# EAGLE design people-counter-74xx (EAGLE 9.1.2)
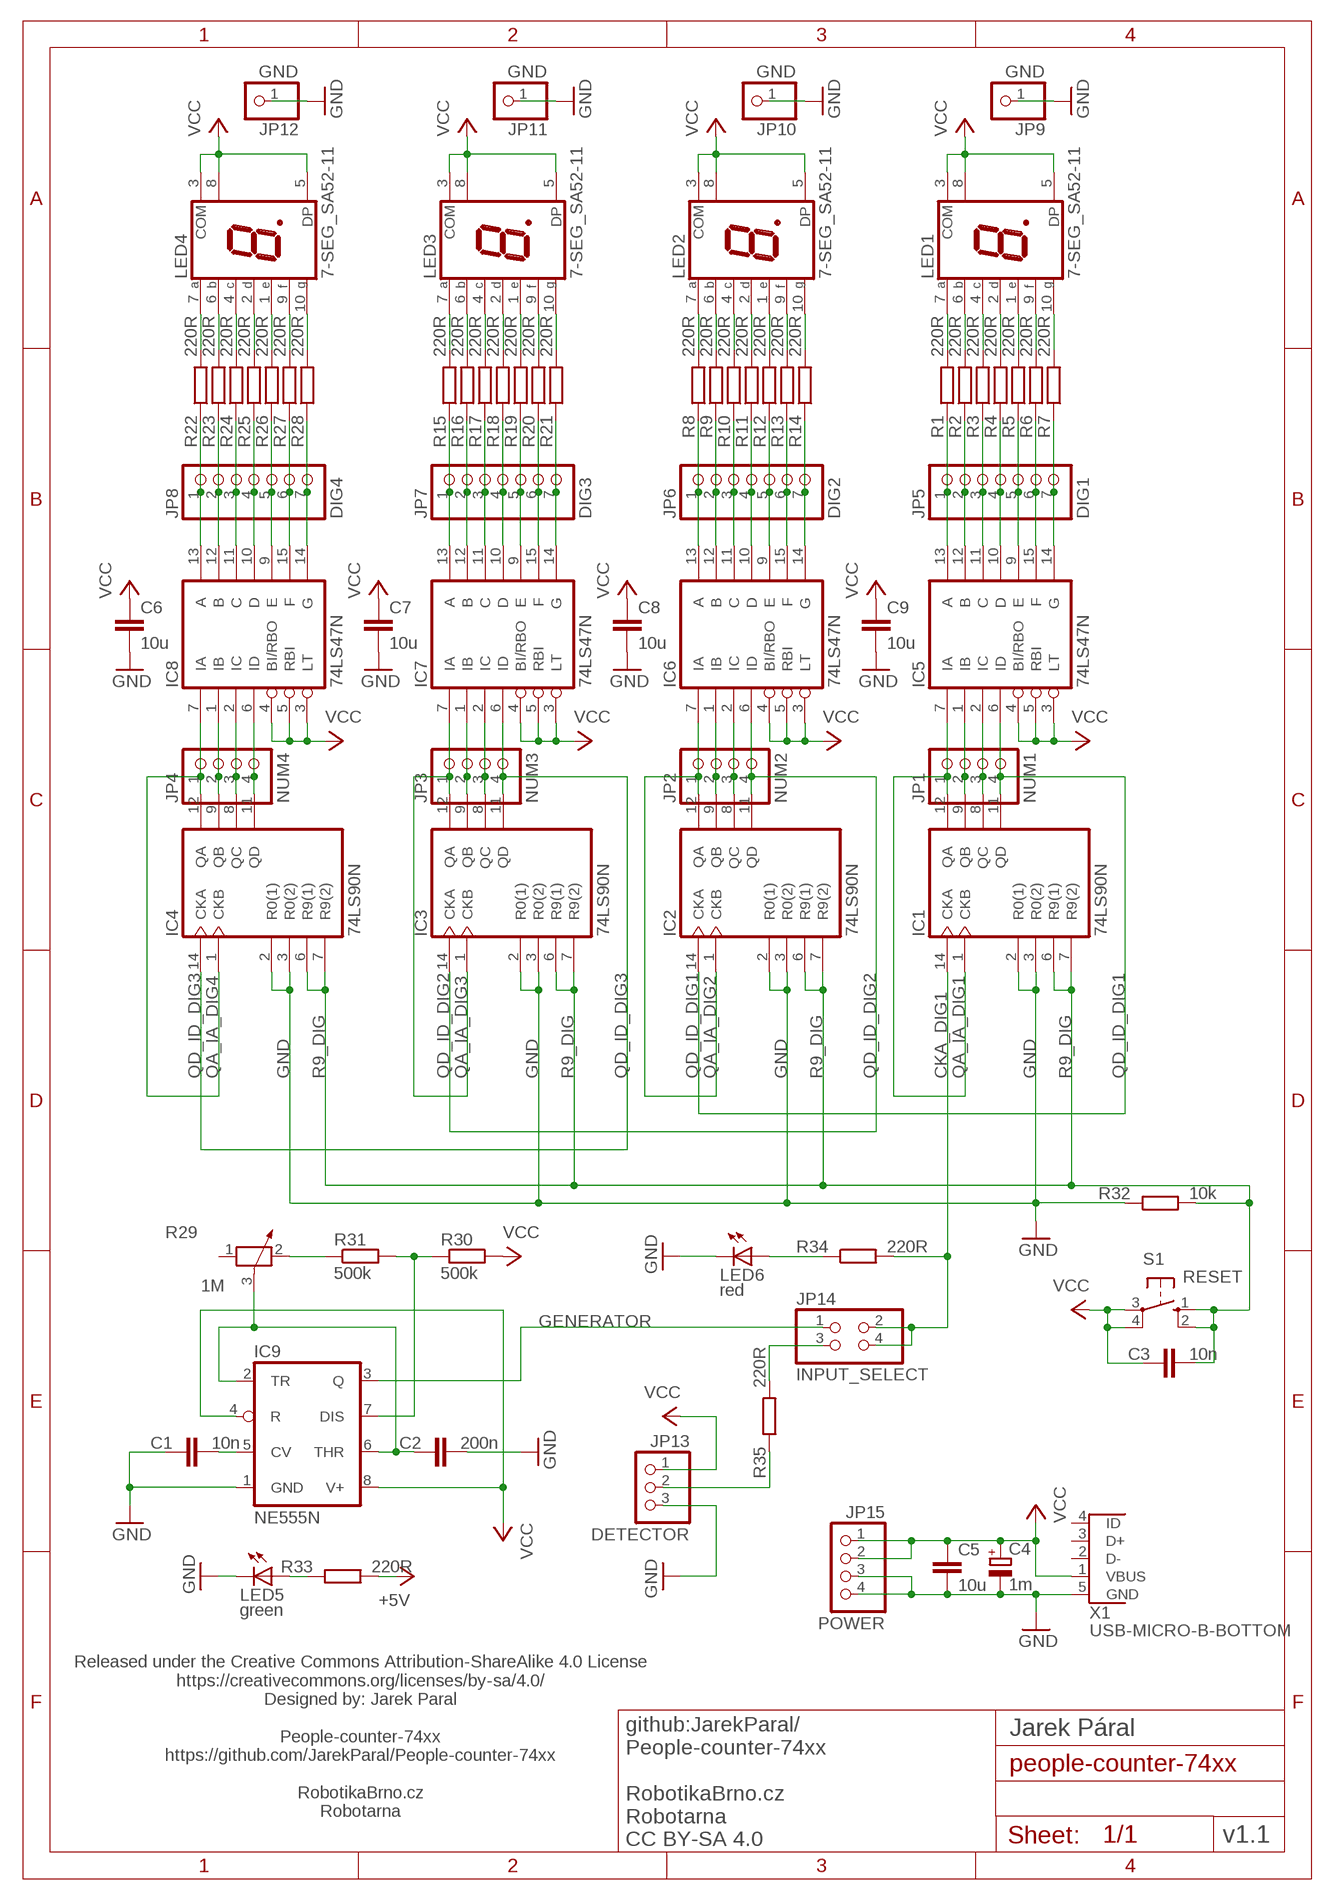
[diagram p0: schematic, sheet 1]

## Parts
C1  10n  C-EUC0603  [C0603]
C2  200n  C-EUC0805  [C0805]
C3  10n  C-EUC0603  [C0603]
C4  1m  CPOL-EUE5-10.5  [E5-10,5]
C5  10u  C-EUC0805  [C0805]
C6  10u  C-EUC0805  [C0805]
C7  10u  C-EUC0805  [C0805]
C8  10u  C-EUC0805  [C0805]
C9  10u  C-EUC0805  [C0805]
IC1  74LS90N  [DIL14]
IC2  74LS90N  [DIL14]
IC3  74LS90N  [DIL14]
IC4  74LS90N  [DIL14]
IC5  74LS47N  [DIL16]
IC6  74LS47N  [DIL16]
IC7  74LS47N  [DIL16]
IC8  74LS47N  [DIL16]
IC9  NE555N  [DIL08]
JP1  NUM1  PINHD-1X4  [1X04]
JP2  NUM2  PINHD-1X4  [1X04]
JP3  NUM3  PINHD-1X4  [1X04]
JP4  NUM4  PINHD-1X4  [1X04]
JP5  DIG1  PINHD-1X7  [1X07]
JP6  DIG2  PINHD-1X7  [1X07]
JP7  DIG3  PINHD-1X7  [1X07]
JP8  DIG4  PINHD-1X7  [1X07]
JP9  GND  PINHD-1X1  [1X01]
JP10  GND  PINHD-1X1  [1X01]
JP11  GND  PINHD-1X1  [1X01]
JP12  GND  PINHD-1X1  [1X01]
JP13  DETECTOR  PINHD-1X3/90  [1X03/90]
JP14  INPUT_SELECT  PINHD-2X2  [2X02]
JP15  POWER  PINHD-1X4/90  [1X04/90]
LED1  7-SEG_SA52-11  [SA52-11]
LED2  7-SEG_SA52-11  [SA52-11]
LED3  7-SEG_SA52-11  [SA52-11]
LED4  7-SEG_SA52-11  [SA52-11]
LED5  green  LEDCHIPLED_0603  [CHIPLED_0603]
LED6  red  LEDCHIPLED_0603  [CHIPLED_0603]
R1  220R  R-EU_R0603  [R0603]
R2  220R  R-EU_R0603  [R0603]
R3  220R  R-EU_R0603  [R0603]
R4  220R  R-EU_R0603  [R0603]
R5  220R  R-EU_R0603  [R0603]
R6  220R  R-EU_R0603  [R0603]
R7  220R  R-EU_R0603  [R0603]
R8  220R  R-EU_R0603  [R0603]
R9  220R  R-EU_R0603  [R0603]
R10  220R  R-EU_R0603  [R0603]
R11  220R  R-EU_R0603  [R0603]
R12  220R  R-EU_R0603  [R0603]
R13  220R  R-EU_R0603  [R0603]
R14  220R  R-EU_R0603  [R0603]
R15  220R  R-EU_R0603  [R0603]
R16  220R  R-EU_R0603  [R0603]
R17  220R  R-EU_R0603  [R0603]
R18  220R  R-EU_R0603  [R0603]
R19  220R  R-EU_R0603  [R0603]
R20  220R  R-EU_R0603  [R0603]
R21  220R  R-EU_R0603  [R0603]
R22  220R  R-EU_R0603  [R0603]
R23  220R  R-EU_R0603  [R0603]
R24  220R  R-EU_R0603  [R0603]
R25  220R  R-EU_R0603  [R0603]
R26  220R  R-EU_R0603  [R0603]
R27  220R  R-EU_R0603  [R0603]
R28  220R  R-EU_R0603  [R0603]
R29  1M  POTENTIOMETER_PT-10  [PT-10]
R30  500k  R-EU_R0603  [R0603]
R31  500k  R-EU_R0603  [R0603]
R32  10k  R-EU_R0603  [R0603]
R33  220R  R-EU_R0603  [R0603]
R34  220R  R-EU_R0603  [R0603]
R35  220R  R-EU_R0603  [R0603]
S1  RESET  10-XX  [B3F-10XX]
X1  USB-MICRO-B-BOTTOM  [USB-MICRO-B-BOTTOM-MOLEX]

## Nets
+5V: R33.2
A_DIG1: IC5.13(A) JP5.1 R1.1
A_DIG2: IC6.13(A) JP6.1 R8.1
A_DIG3: IC7.13(A) JP7.1 R15.1
A_DIG4: IC8.13(A) JP8.1 R22.1
A_DIG_1: LED1.7(A) R1.2
A_DIG_2: LED2.7(A) R8.2
A_DIG_3: LED3.7(A) R15.2
A_DIG_4: LED4.7(A) R22.2
B_DIG1: IC5.12(B) JP5.2 R2.1
B_DIG2: IC6.12(B) JP6.2 R9.1
B_DIG3: IC7.12(B) JP7.2 R16.1
B_DIG4: IC8.12(B) JP8.2 R23.1
B_DIG_1: LED1.6(B) R2.2
B_DIG_2: LED2.6(B) R9.2
B_DIG_3: LED3.6(B) R16.2
B_DIG_4: LED4.6(B) R23.2
C_DIG1: IC5.11(C) JP5.3 R3.1
C_DIG2: IC6.11(C) JP6.3 R10.1
C_DIG3: IC7.11(C) JP7.3 R17.1
C_DIG4: IC8.11(C) JP8.3 R24.1
C_DIG_1: LED1.4(C) R3.2
C_DIG_2: LED2.4(C) R10.2
C_DIG_3: LED3.4(C) R17.2
C_DIG_4: LED4.4(C) R24.2
CKA_DIG1: IC1.14(CKA) JP14.2 JP14.4 R34.2
D_DIG1: IC5.10(D) JP5.4 R4.1
D_DIG2: IC6.10(D) JP6.4 R11.1
D_DIG3: IC7.10(D) JP7.4 R18.1
D_DIG4: IC8.10(D) JP8.4 R25.1
D_DIG_1: LED1.2(D) R4.2
D_DIG_2: LED2.2(D) R11.2
D_DIG_3: LED3.2(D) R18.2
D_DIG_4: LED4.2(D) R25.2
E_DIG1: IC5.9(E) JP5.5 R5.1
E_DIG2: IC6.9(E) JP6.5 R12.1
E_DIG3: IC7.9(E) JP7.5 R19.1
E_DIG4: IC8.9(E) JP8.5 R26.1
E_DIG_1: LED1.1(E) R5.2
E_DIG_2: LED2.1(E) R12.2
E_DIG_3: LED3.1(E) R19.2
E_DIG_4: LED4.1(E) R26.2
F_DIG1: IC5.15(F) JP5.6 R6.1
F_DIG2: IC6.15(F) JP6.6 R13.1
F_DIG3: IC7.15(F) JP7.6 R20.1
F_DIG4: IC8.15(F) JP8.6 R27.1
F_DIG_1: LED1.9(F) R6.2
F_DIG_2: LED2.9(F) R13.2
F_DIG_3: LED3.9(F) R20.2
F_DIG_4: LED4.9(F) R27.2
G_DIG1: IC5.14(G) JP5.7 R7.1
G_DIG2: IC6.14(G) JP6.7 R14.1
G_DIG3: IC7.14(G) JP7.7 R21.1
G_DIG4: IC8.14(G) JP8.7 R28.1
G_DIG_1: LED1.10(G) R7.2
G_DIG_2: LED2.10(G) R14.2
G_DIG_3: LED3.10(G) R21.2
G_DIG_4: LED4.10(G) R28.2
GENERATOR: IC9.3(Q) JP14.1
GND: C1.1 C2.2 C4.- C5.2 C6.2 C7.2 C8.2 C9.2 IC1.2(R0(1)) IC1.3(R0(2)) IC2.2(R0(1)) IC2.3(R0(2)) IC3.2(R0(1)) IC3.3(R0(2)) IC4.2(R0(1)) IC4.3(R0(2)) IC9.1(GND) JP9.1 JP10.1 JP11.1 JP12.1 JP13.3 JP15.3 JP15.4 LED5.C LED6.C R32.1 X1.5(GND)
N$1: LED6.A R34.1
N$2: R29.2 R31.1
N$3: C2.1 IC9.2(TR) IC9.6(THR) R29.3
N$4: C1.2 IC9.5(CV)
N$6: IC9.7(DIS) R30.1 R31.2
N$11: LED5.A R33.1
QA_IA_DIG1: IC1.1(CKB) IC1.12(QA) IC5.7(IA) JP1.1
QA_IA_DIG2: IC2.1(CKB) IC2.12(QA) IC6.7(IA) JP2.1
QA_IA_DIG3: IC3.1(CKB) IC3.12(QA) IC7.7(IA) JP3.1
QA_IA_DIG4: IC4.1(CKB) IC4.12(QA) IC8.7(IA) JP4.1
QB_IB_DIG1: IC1.9(QB) IC5.1(IB) JP1.2
QB_IB_DIG2: IC2.9(QB) IC6.1(IB) JP2.2
QB_IB_DIG3: IC3.9(QB) IC7.1(IB) JP3.2
QB_IB_DIG4: IC4.9(QB) IC8.1(IB) JP4.2
QC_IC_DIG1: IC1.8(QC) IC5.2(IC) JP1.3
QC_IC_DIG2: IC2.8(QC) IC6.2(IC) JP2.3
QC_IC_DIG3: IC3.8(QC) IC7.2(IC) JP3.3
QC_IC_DIG4: IC4.8(QC) IC8.2(IC) JP4.3
QD_ID_DIG1: IC1.11(QD) IC2.14(CKA) IC5.6(ID) JP1.4
QD_ID_DIG2: IC2.11(QD) IC3.14(CKA) IC6.6(ID) JP2.4
QD_ID_DIG3: IC3.11(QD) IC4.14(CKA) IC7.6(ID) JP3.4
QD_ID_DIG4: IC4.11(QD) IC8.6(ID) JP4.4
R9_DIG: C3.2 IC1.6(R9(1)) IC1.7(R9(2)) IC2.6(R9(1)) IC2.7(R9(2)) IC3.6(R9(1)) IC3.7(R9(2)) IC4.6(R9(1)) IC4.7(R9(2)) R32.2 S1.1(S) S1.2(S1)
SIGNAL_INPUT: JP13.2 R35.1
SIGNAL_INPUT_: JP14.3 R35.2
VCC: C3.1 C4.+ C5.1 C6.1 C7.1 C8.1 C9.1 IC5.3(LT) IC5.4(BI/RBO) IC5.5(RBI) IC6.3(LT) IC6.4(BI/RBO) IC6.5(RBI) IC7.3(LT) IC7.4(BI/RBO) IC7.5(RBI) IC8.3(LT) IC8.4(BI/RBO) IC8.5(RBI) IC9.4(R) IC9.8(V+) JP13.1 JP15.1 JP15.2 LED1.3(COM) LED1.5(DP) LED1.8(COM) LED2.3(COM) LED2.5(DP) LED2.8(COM) LED3.3(COM) LED3.5(DP) LED3.8(COM) LED4.3(COM) LED4.5(DP) LED4.8(COM) R30.2 S1.3(P) S1.4(P1) X1.1(VBUS)
Unconnected: R29.1 X1.2(D-) X1.3(D+) X1.4(ID)

## Notes on the sheet
- Released under the Creative Commons Attribution-ShareAlike 4.0 License
  https://creativecommons.org/licenses/by-sa/4.0/
  Designed by: Jarek Paral
  
  People-counter-74xx
  https://github.com/JarekParal/People-counter-74xx
  
  RobotikaBrno.cz
  Robotarna
- Jarek Páral
- v1.1
- github:JarekParal/
  People-counter-74xx
  
  RobotikaBrno.cz
  Robotarna
  CC BY-SA 4.0

## Power pins joined to a net without a drawn wire
GND: IC1.10(GND) IC2.10(GND) IC3.10(GND) IC4.10(GND) IC5.8(GND) IC6.8(GND) IC7.8(GND) IC8.8(GND)
VCC: IC1.5(VCC) IC2.5(VCC) IC3.5(VCC) IC4.5(VCC) IC5.16(VCC) IC6.16(VCC) IC7.16(VCC) IC8.16(VCC)

## Library data of the parts
C1-C3 C5-C9 = rcl:C-EU: CAPACITOR, European symbol; SPICEPREFIX: C
C4 = rcl:CPOL-EU: POLARIZED CAPACITOR, European symbol; SPICEPREFIX: C
IC1-IC4 = 74xx-eu:74*90: Decade, divide by twelve and binary COUNTER
IC5-IC8 = 74xx-eu:74*47: BCD to seven segment DECODER/DRIVER Source: http://www.ee.washington.edu/stores/DataSheets/74ls/74ls47.pdf
IC9 = linear:*555: TIMER
JP1-JP4 JP15 = pinhead:PINHD-1X4: PIN HEADER
JP5-JP8 = pinhead:PINHD-1X7: PIN HEADER
JP9-JP12 = pinhead:PINHD-1X1: PIN HEADER
JP13 = pinhead:PINHD-1X3: PIN HEADER
JP14 = pinhead:PINHD-2X2: PIN HEADER
LED1-LED4 = display-kingbright:7-SEG_: Kingbright 14.2mm (0.56 INCH) SINGLE DIGIT NUMERIC DUISPLAY Source: SA56-11EWA(Ver1189471036.pdf; OC_FARNELL: unknown; OC_NEWARK: unknown
LED5 LED6 = led:LED: LED OSRAM: - CHIPLED LG R971, LG N971, LY N971, LG Q971, LY Q971, LO R971, LY R971 LH N974, LH R974 LS Q976, LO Q976, LY Q976 LO Q996 - Hyper CHIPLED LW Q18S LB Q993, LB Q99A, LB R99A - SideLED LS A670, LO A670, LY A670, LG A670, LP A670 LB A673, LV A673, LT A673, LW A673 LH A674 LY A675 LS A676, LA A676, LO A676, LY A676, LW A676 LS A679, LY A679, LG A679 - Hyper Micro SIDELED® LS Y876, LA Y876, LO Y876, LY Y876 LT Y87S - SmartLED LW L88C, LW L88S LB L89C, LB L89S, LG L890 LS L89K, LO L89K, LY L89K LS L896, LA L896, LO L896, LY L896 - TOPLED LS T670, LO T670, LY T670, LG T670, LP T670 LSG T670, LSP T670, LSY T670, LOP T670, LYG T670 LG T671, LOG T671, LSG T671 LB T673, LV T673, LT T673, LW T673 LH T674 LS T676, LA T676, LO T676, LY T676, LB T676, LH T676, LSB T676, LW T676 LB T67C, LV T67C, LT T67C, LS T67K, LO T67K, LY T67K, LW E67C LS E67B, LA E67B, LO E67B, LY E67B, LB E67C, LV E67C, LT E67C LW T67C LS T679, LY T679, LG T679 LS T770, LO T770, LY T770, LG T770, LP T770 LB T773, LV T773, LT T773, LW T773 LH T774 LS E675, LA E675, LY E675, LS T675 LS T776, LA T776, LO T776, LY T776, LB T776 LHGB T686 LT T68C, LB T68C - Hyper Mini TOPLED® LB M676 - Mini TOPLED Santana® LG M470 LS M47K, LO M47K, LY M47K Source: http://www.osram.convergy.de LUXEON: - LUMILED® LXK2-PW12-R00, LXK2-PW12-S00, LXK2-PW14-U00, LXK2-PW14-V00 LXK2-PM12-R00, LXK2-PM12-S00, LXK2-PM14-U00 LXK2-PE12-Q00, LXK2-PE12-R00, LXK2-PE12-S00, LXK2-PE14-T00, LXK2-PE14-U00 LXK2-PB12-K00, LXK2-PB12-L00, LXK2-PB12-M00, LXK2-PB14-N00, LXK2-PB14-P00, LXK2-PB14-Q00 LXK2-PR12-L00, LXK2-PR12-M00, LXK2-PR14-Q00, LXK2-PR14-R00 LXK2-PD12-Q00, LXK2-PD12-R00, LXK2-PD12-S00 LXK2-PH12-R00, LXK2-PH12-S00 LXK2-PL12-P00, LXK2-PL12-Q00, LXK2-PL12-R00 Source: www.luxeon.com KINGBRIGHT: KA-3528ASYC Source: www.kingbright.com
R1-R28 R30-R35 = rcl:R-EU_: RESISTOR, European symbol; SPICEPREFIX: R
R29 = rcl:POTENTIOMETER_: Potentiometer; OC_GME: 112-058; SPICEMODEL: POT; SPICEPREFIX: X
S1 = switch-omron:10-XX: OMRON SWITCH; MPN: B3F-1000; OC_FARNELL: 176432; OC_NEWARK: 36M3542
X1 = usb:USB

## Board
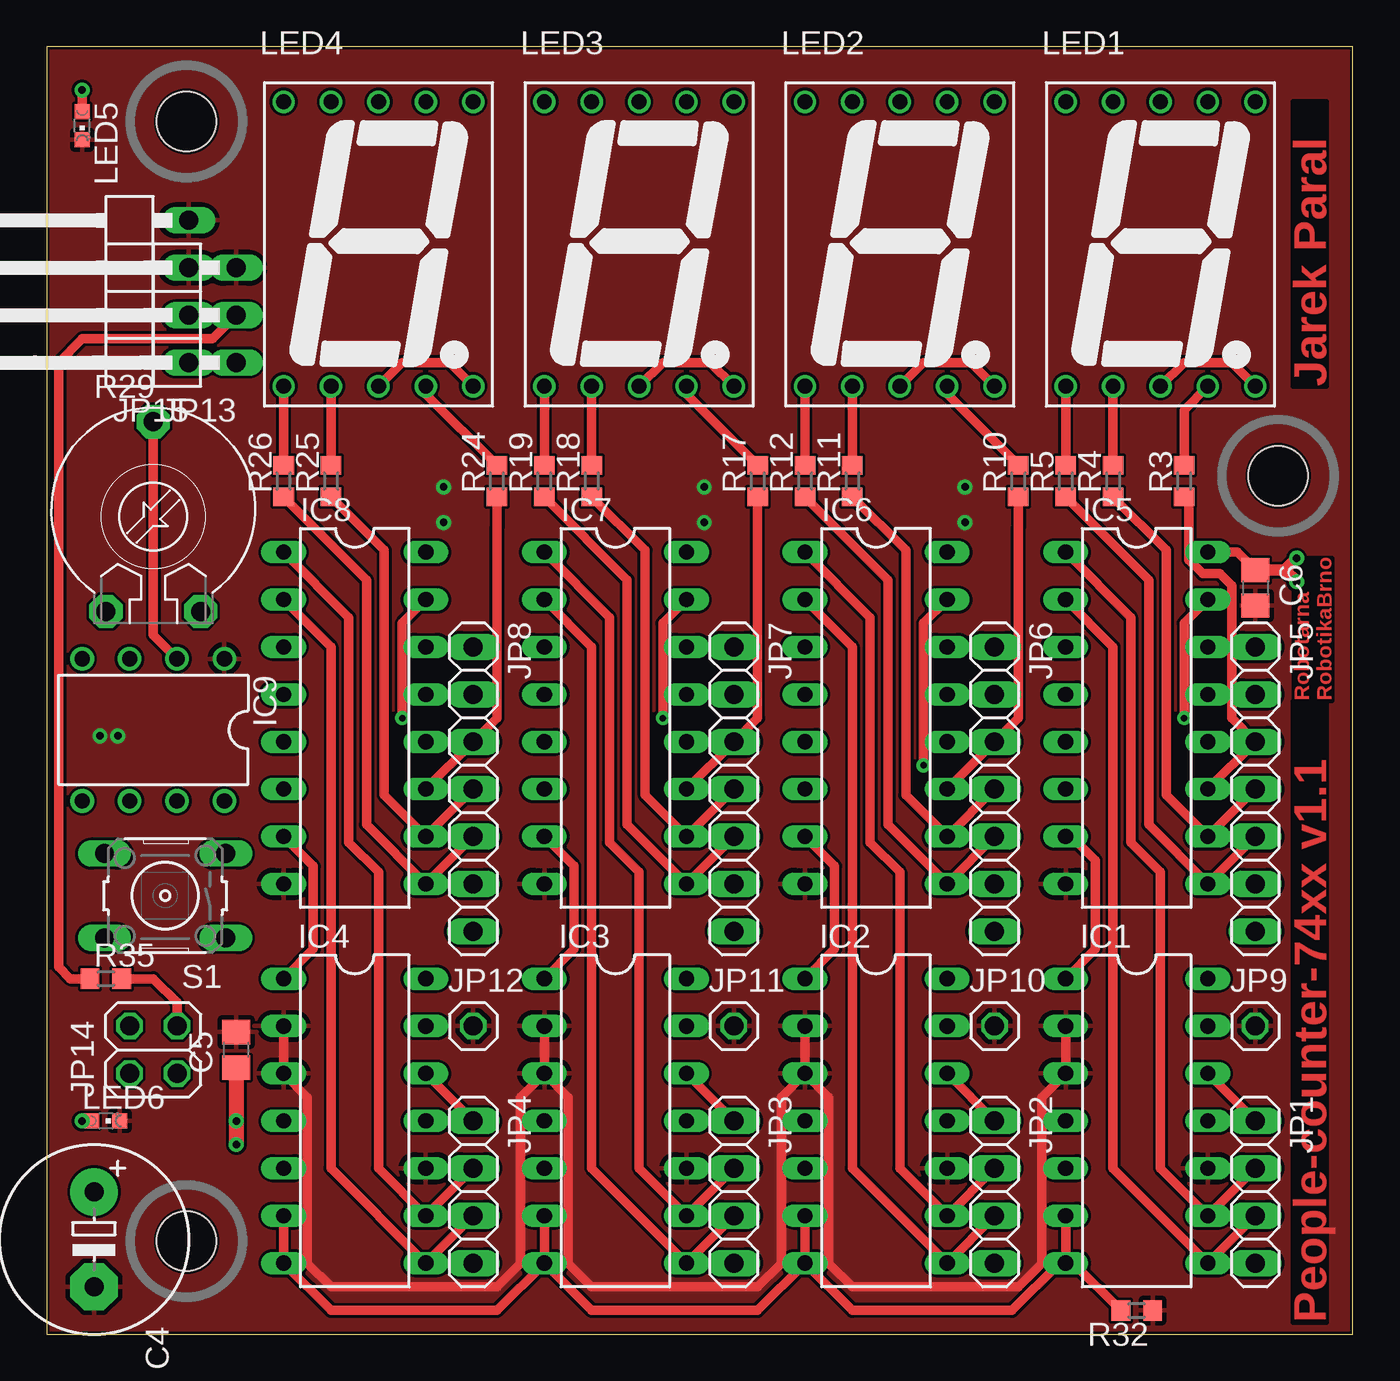
[diagram p1: board, top side]
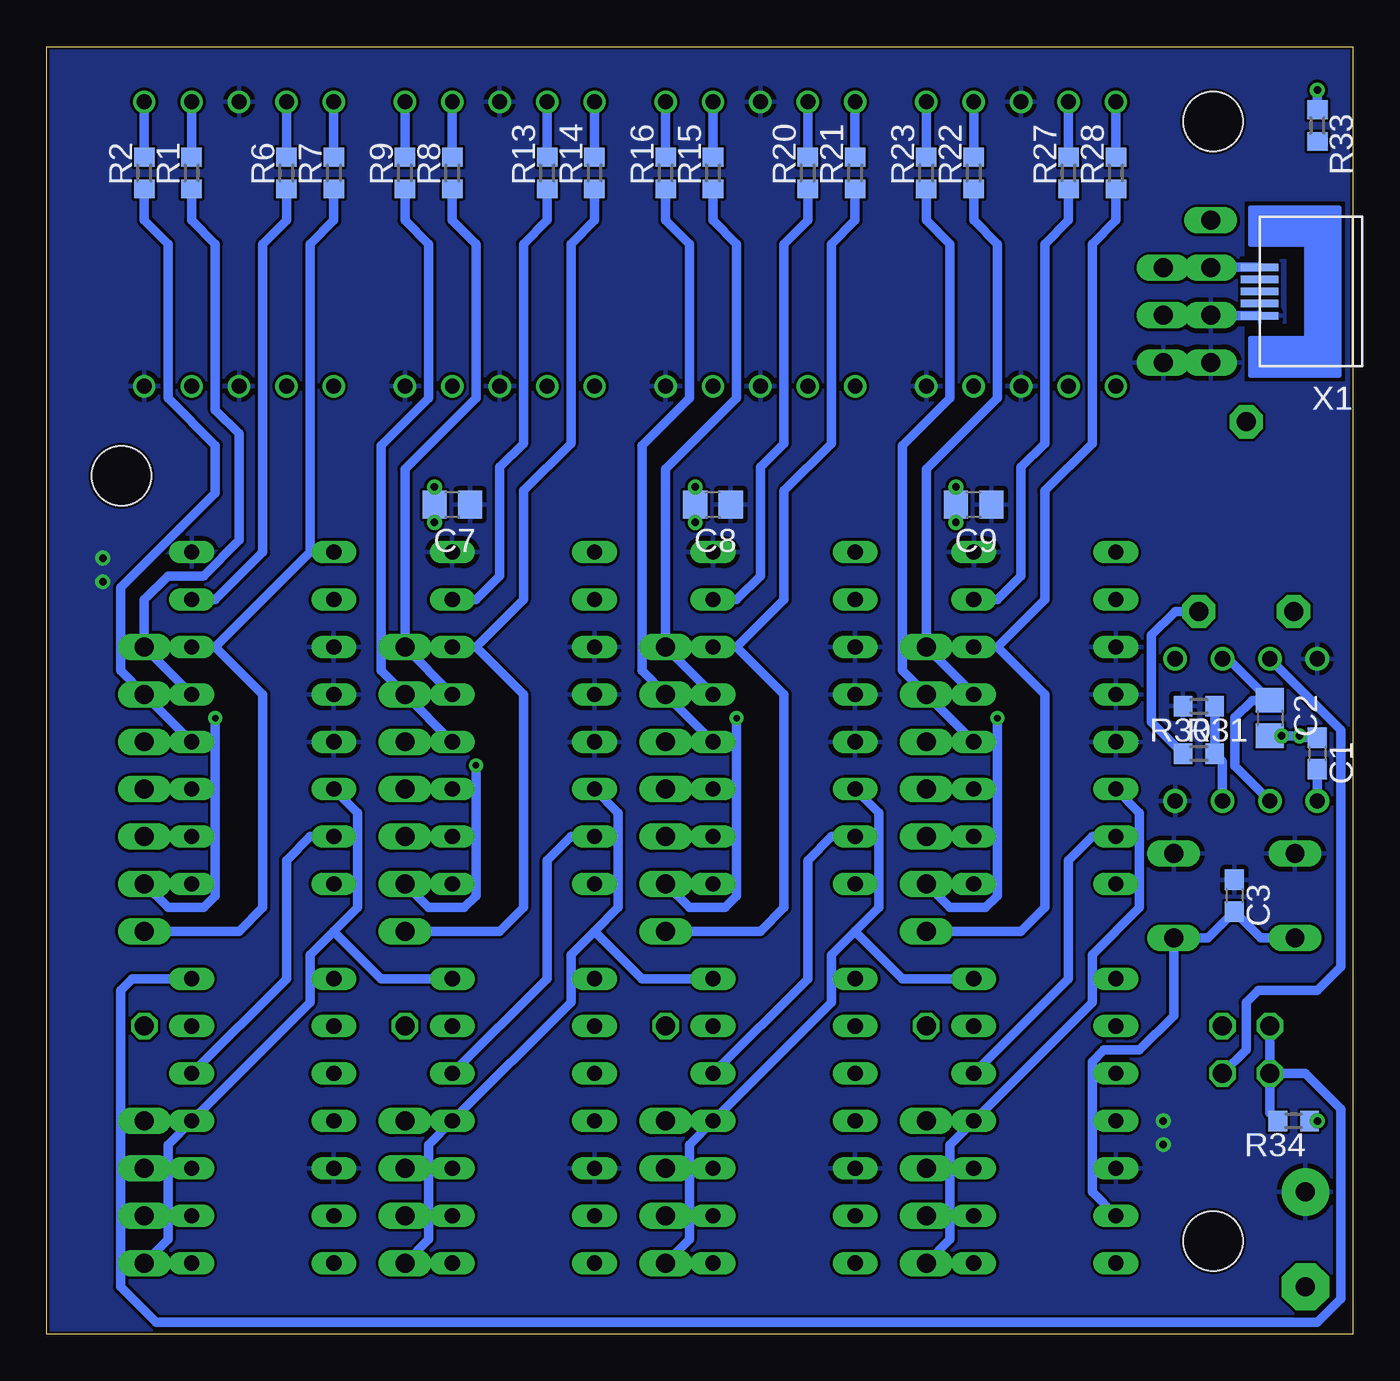
[diagram p2: board, bottom side, seen from below]

Size 70 x 69 mm. Coordinates in mm from the lower left corner, seen from the top.
Outline: 0,0 70,0 70,69 0,69 0,0
Copper layers (1*16): Top 0.035mm / dielectric 1.5mm / Bottom 0.035mm
Design rules "gatema_2layers": minimum track width 0.15mm, minimum drill 0.3mm, track to track 0.15mm, track to pad 0.15mm, pad to pad 0.15mm, via to via 0.15mm, smd to smd 0mil, copper to edge 0.15mm, drill to drill 0.4mm, minimum pad ring 0.2mm, minimum via ring 0.2mm, stop-mask expansion 2mil, vias tented up to drill 0.4mm, thermal gap 10mil
Holes 3.2 mm at 66,46 7.5,65 7.5,5

### Footprints (pad centres in the part's own frame; a part is rotated, then mirrored left to right if it is on the bottom)
C0603 = smd 1.1 x 1: 1 -0.85,0; 2 0.85,0
C0805 = smd 1.3 x 1.5: 1 -0.95,0; 2 0.95,0
E5-10,5 = drill 1.016 pad 2.54: + -2.54,0 | drill 1.016 pad 2.54 octagon: - 2.54,0
DIL14 = drill 0.813 long: 1 -7.62,-3.81; 2 -5.08,-3.81; 3 -2.54,-3.81; 4 0,-3.81; 5 2.54,-3.81; 6 5.08,-3.81; 7 7.62,-3.81; 8 7.62,3.81; 9 5.08,3.81; 10 2.54,3.81; 11 0,3.81; 12 -2.54,3.81; 13 -5.08,3.81; 14 -7.62,3.81
DIL16 = drill 0.813 long: 1 -8.89,-3.81; 2 -6.35,-3.81; 3 -3.81,-3.81; 4 -1.27,-3.81; 5 1.27,-3.81; 6 3.81,-3.81; 7 6.35,-3.81; 8 8.89,-3.81; 9 8.89,3.81; 10 6.35,3.81; 11 3.81,3.81; 12 1.27,3.81; 13 -1.27,3.81; 14 -3.81,3.81; 15 -6.35,3.81; 16 -8.89,3.81
DIL08 = drill 0.813 pad 1.27: 1 -3.81,-3.81; 2 -1.27,-3.81; 3 1.27,-3.81; 4 3.81,-3.81; 5 3.81,3.81; 6 1.27,3.81; 7 -1.27,3.81; 8 -3.81,3.81
1X04 = drill 1.016 long: 1 -3.81,0; 2 -1.27,0; 3 1.27,0; 4 3.81,0
1X07 = drill 1.016 long: 1 -7.62,0; 2 -5.08,0; 3 -2.54,0; 4 0,0; 5 2.54,0; 6 5.08,0; 7 7.62,0
1X01 = drill 1.016 octagon: 1 0,0
1X03/90 = drill 1.016 long: 1 -2.54,-3.81; 2 0,-3.81; 3 2.54,-3.81
2X02 = drill 1.016 octagon: 1 -1.27,-1.27; 2 -1.27,1.27; 3 1.27,-1.27; 4 1.27,1.27
1X04/90 = drill 1.016 long: 1 -3.81,-3.81; 2 -1.27,-3.81; 3 1.27,-3.81; 4 3.81,-3.81
SA52-11 = drill 0.8: 1 -5.08,-7.62; 2 -2.54,-7.62; 3 0,-7.62; 4 2.54,-7.62; 5 5.08,-7.62; 6 5.08,7.62; 7 2.54,7.62; 8 0,7.62; 9 -2.54,7.62; 10 -5.08,7.62
CHIPLED_0603 = smd 0.8 x 0.8: A 0,-0.75; C 0,0.75
R0603 = smd 1 x 1.1: 1 -0.85,0; 2 0.85,0
PT-10 = drill 1.016 pad 1.778 octagon: 1 -2.54,-5.08; 2 2.54,-5.08; 3 0,5.08
B3F-10XX = drill 1.016 long: 1 -3.251,2.261; 2 3.251,2.261; 3 -3.251,-2.261; 4 3.251,-2.261
USB-MICRO-B-BOTTOM-MOLEX = smd 2 x 0.4: 1 5,1.3; 2 5,0.65; 3 5,0; 4 5,-0.65; 5 5,-1.3

### Placement (x,y rotation side)
C1  1.91,31.11 270 bottom
C2  4.45,33.02 270 bottom
C3  6.35,23.5 270 bottom
C4  2.54,5.08 270 top
C5  10.16,15.24 90 top
C6  64.77,40.01 270 top
C7  48.26,44.45 180 bottom
C8  34.29,44.45 180 bottom
C9  20.32,44.45 180 bottom
IC1  58.42,11.43 270 top
IC2  44.45,11.43 270 top
IC3  30.48,11.43 270 top
IC4  16.51,11.43 270 top
IC5  58.42,33.02 270 top
IC6  44.45,33.02 270 top
IC7  30.48,33.02 270 top
IC8  16.51,33.02 270 top
IC9  5.71,32.38 180 top
JP1  64.77,7.62 270 top
JP2  50.8,7.62 270 top
JP3  36.83,7.62 270 top
JP4  22.86,7.62 270 top
JP5  64.77,29.21 270 top
JP6  50.8,29.21 270 top
JP7  36.83,29.21 270 top
JP8  22.86,29.21 270 top
JP9  64.77,16.51 0 top
JP10  50.8,16.51 0 top
JP11  36.83,16.51 0 top
JP12  22.86,16.51 0 top
JP13  6.35,54.61 90 top
JP14  5.71,15.24 90 top
JP15  3.81,55.88 90 top
LED1  59.69,58.42 0 top
LED2  45.72,58.42 0 top
LED3  31.75,58.42 0 top
LED4  17.78,58.42 0 top
LED5  1.91,64.77 180 top
LED6  3.17,11.43 270 top
R1  62.23,62.23 90 bottom
R2  64.77,62.23 90 bottom
R3  60.96,45.72 90 top
R4  57.15,45.72 90 top
R5  54.61,45.72 90 top
R6  57.15,62.23 90 bottom
R7  54.61,62.23 90 bottom
R8  48.26,62.23 90 bottom
R9  50.8,62.23 90 bottom
R10  52.07,45.72 90 top
R11  43.18,45.72 90 top
R12  40.64,45.72 90 top
R13  43.18,62.23 90 bottom
R14  40.64,62.23 90 bottom
R15  34.29,62.23 90 bottom
R16  36.83,62.23 90 bottom
R17  38.1,45.72 90 top
R18  29.21,45.72 90 top
R19  26.67,45.72 90 top
R20  29.21,62.23 90 bottom
R21  26.67,62.23 90 bottom
R22  20.32,62.23 90 bottom
R23  22.86,62.23 90 bottom
R24  24.13,45.72 90 top
R25  15.24,45.72 90 top
R26  12.7,45.72 90 top
R27  15.24,62.23 90 bottom
R28  12.7,62.23 90 bottom
R29  5.71,43.81 0 top
R30  8.26,33.66 180 bottom
R31  8.26,31.11 0 bottom
R32  58.42,1.27 180 top
R33  1.91,64.77 270 bottom
R34  3.17,11.43 180 bottom
R35  3.17,19.05 0 top
S1  6.35,23.5 180 top
X1  0,55.88 180 bottom

### Tracks (layer width: path | path; a pad name or v marks a point on that pad's centre or on a via)
A_DIG1
  Bottom 0.508: R1.1 62.23,59.69 60.96,58.42 60.96,49.53 59.69,48.26 59.69,42.55 61.59,40.64 63.5,40.64 64.77,39.37 JP5.1 IC5.13
A_DIG2
  Bottom 0.508: R8.1 48.26,59.69 46.99,58.42 46.99,50.16 50.8,46.35 JP6.1 IC6.13
A_DIG3
  Bottom 0.508: R15.1 34.29,59.69 33.02,58.42 33.02,50.16 36.83,46.35 JP7.1 IC7.13
A_DIG4
  Bottom 0.508: R22.1 20.32,59.69 19.05,58.42 19.05,50.16 22.86,46.35 JP8.1 IC8.13
A_DIG_1
  Bottom 0.508: R1.2 LED1.7
A_DIG_2
  Bottom 0.508: R8.2 LED2.7
A_DIG_3
  Bottom 0.508: R15.2 LED3.7
A_DIG_4
  Bottom 0.508: R22.2 LED4.7
B_DIG1
  Bottom 0.508: R2.1 64.77,59.69 63.5,58.42 63.5,50.16 60.96,47.62 60.96,45.09 62.87,43.18 66.04,40.01 66.04,35.56 JP5.2 IC5.12
B_DIG2
  Bottom 0.508: R9.1 50.8,59.69 49.53,58.42 49.53,50.16 52.07,47.62 52.07,43.18 52.07,35.56 JP6.2 IC6.12
B_DIG3
  Bottom 0.508: R16.1 36.83,59.69 35.56,58.42 35.56,50.16 38.1,47.62 38.1,35.56 JP7.2 IC7.12
B_DIG4
  Bottom 0.508: R23.1 22.86,59.69 21.59,58.42 21.59,50.16 24.13,47.62 24.13,35.56 JP8.2 IC8.12
B_DIG_1
  Bottom 0.508: LED1.6 R2.2
B_DIG_2
  Bottom 0.508: LED2.6 R9.2
B_DIG_3
  Bottom 0.508: LED3.6 R16.2
B_DIG_4
  Bottom 0.508: LED4.6 R23.2
C_DIG1
  Top 0.508: IC5.11 JP5.3 63.5,33.02 63.5,40.12 62.87,40.75 61.96,40.75 61.22,41.49 61.22,44.61 R3.1
C_DIG2
  Top 0.508: IC6.11 JP6.3 52.07,33.02 52.07,42.55 52.07,43.18 R10.1
C_DIG3
  Top 0.508: IC7.11 JP7.3 38.1,33.02 R17.1
C_DIG4
  Top 0.508: IC8.11 JP8.3 24.13,33.02 24.13,42.55 24.13,43.18 R24.1
C_DIG_1
  Top 0.508: R3.2 60.96,49.53 LED1.4
C_DIG_2
  Top 0.508: R10.2 48.26,50.38 LED2.4
C_DIG_3
  Top 0.508: LED3.4 34.29,50.38 R17.2
C_DIG_4
  Top 0.508: R24.2 20.32,50.38 LED4.4
CKA_DIG1
  Bottom 0.508: IC1.14 65.41,19.05 66.04,18.41 66.04,2.54 64.14,0.64 1.91,0.64 0.64,1.91 0.64,12.06 2.54,13.97 JP14.2 | R34.2 4.45,11.85 JP14.2 | JP14.4 JP14.2
D_DIG1
  Top 0.508: JP5.4 IC5.10 60.01,28.89 60.01,42.01 R4.1
D_DIG2
  Top 0.508: JP6.4 IC6.10 46.04,28.89 46.04,42.01 R11.1
D_DIG3
  Top 0.508: JP7.4 IC7.10 32.07,28.89 32.07,42.01 R18.1
D_DIG4
  Top 0.508: JP8.4 IC8.10 18.1,28.89 18.1,42.01 R25.1
D_DIG_1
  Top 0.508: R4.2 LED1.2
D_DIG_2
  Top 0.508: R11.2 LED2.2
D_DIG_3
  Top 0.508: R18.2 LED3.2
D_DIG_4
  Top 0.508: R25.2 LED4.2
E_DIG1
  Top 0.508: JP5.5 IC5.9 59.05,27.3 59.05,40.42 R5.1
E_DIG2
  Top 0.508: JP6.5 IC6.9 45.09,27.3 45.09,40.42 R12.1
E_DIG3
  Top 0.508: JP7.5 IC7.9 31.11,27.3 31.11,40.42 R19.1
E_DIG4
  Top 0.508: JP8.5 IC8.9 17.14,27.3 17.14,40.42 R26.1
E_DIG_1
  Top 0.508: R5.2 LED1.1
E_DIG_2
  Top 0.508: R12.2 LED2.1
E_DIG_3
  Top 0.508: R19.2 LED3.1
E_DIG_4
  Top 0.508: R26.2 LED4.1
F_DIG1  (via drill 0.35)
  Top 0.508: IC5.15 60.96,38.1 v60.96,33.02
  Bottom 0.508: R6.1 57.15,59.69 58.42,58.42 58.42,41.91 60.96,39.37 IC5.15 | JP5.6 63.5,22.86 61.59,22.86 60.96,23.5 v60.96,33.02
F_DIG2  (via drill 0.35)
  Top 0.508: IC6.15 46.99,38.1 v46.99,30.48
  Bottom 0.508: R13.1 43.18,59.69 44.45,58.42 44.45,50.16 44.45,47.74 45.72,46.47 45.72,40.64 46.99,39.37 IC6.15 | JP6.6 49.53,22.86 47.62,22.86 46.99,23.5 v46.99,30.48
F_DIG3  (via drill 0.35)
  Top 0.508: IC7.15 33.02,38.1 v33.02,33.02
  Bottom 0.508: R20.1 29.21,59.69 30.48,58.42 30.48,49.53 30.48,47.74 31.75,46.47 31.75,40.64 33.02,39.37 IC7.15 | JP7.6 35.56,22.86 33.66,22.86 33.02,23.5 v33.02,33.02
F_DIG4  (via drill 0.35)
  Top 0.508: IC8.15 19.05,38.1 v19.05,33.02
  Bottom 0.508: R27.1 15.24,59.69 16.51,58.42 16.51,47.74 17.78,46.47 17.78,40.64 19.05,39.37 IC8.15 | JP8.6 21.59,22.86 19.68,22.86 19.05,23.5 v19.05,33.02
F_DIG_1
  Bottom 0.508: R6.2 LED1.9
F_DIG_2
  Bottom 0.508: R13.2 LED2.9
F_DIG_3
  Bottom 0.508: R20.2 LED3.9
F_DIG_4
  Bottom 0.508: R27.2 LED4.9
G_DIG1
  Bottom 0.508: R7.1 54.61,59.69 55.88,58.42 55.88,41.91 60.96,36.83 | IC5.14 60.96,36.83 | 60.96,36.83 58.42,34.29 58.42,22.86 59.69,21.59 JP5.7
G_DIG2
  Bottom 0.508: R14.1 40.64,59.69 41.91,58.42 41.91,47.74 44.45,45.2 44.45,39.37 46.99,36.83 | IC6.14 46.99,36.83 | 46.99,36.83 44.45,34.29 44.45,22.86 45.72,21.59 JP6.7
G_DIG3
  Bottom 0.508: R21.1 26.67,59.69 27.94,58.42 27.94,47.74 30.48,45.2 30.48,39.37 33.02,36.83 | IC7.14 33.02,36.83 | 33.02,36.83 30.48,34.29 30.48,22.86 31.75,21.59 JP7.7
G_DIG4
  Bottom 0.508: R28.1 12.7,59.69 13.97,58.42 13.97,47.74 16.51,45.2 16.51,39.37 19.05,36.83 | IC8.14 19.05,36.83 | 19.05,36.83 16.51,34.29 16.51,22.86 17.78,21.59 JP8.7
G_DIG_1
  Bottom 0.508: R7.2 LED1.10
G_DIG_2
  Bottom 0.508: R14.2 LED2.10
G_DIG_3
  Bottom 0.508: R21.2 LED3.10
G_DIG_4
  Bottom 0.508: R28.2 LED4.10
GENERATOR
  Bottom 0.508: IC9.3 0.64,32.38 0.64,22.23 0.64,19.68 1.91,18.41 5.08,18.41 5.71,17.78 5.71,15.24 JP14.1
GND  (via drill 0.4)
  Top 0.508: IC3.3 IC3.2 | IC2.3 IC2.2 | IC4.2 IC4.3 13.97,12.7 13.97,3.81 15.24,2.54 24.13,2.54 25.4,3.81 25.4,12.7 IC3.3 | IC1.2 IC1.3 53.34,12.7 53.34,3.81 52.07,2.54 43.18,2.54 41.91,3.81 41.91,12.7 IC2.3 | IC3.3 27.94,12.7 27.94,3.81 29.21,2.54 38.1,2.54 39.37,3.81 39.37,12.7 IC2.3
  Bottom 0.508: X1.5 7.59,57.18 | 7.59,57.18 JP15.3 | 7.62,57.21 7.59,57.18 | C1.1 2.75,31.96 v2.86,32.07 v3.81,32.07 C2.2 | v21.27,45.4 C9.2 v21.27,43.5 | v49.21,43.5 C7.2 v49.21,45.4 | v35.24,45.4 C8.2 v35.24,43.5
  pour Top: 0,69 0,0 70,0 70,69
N$1  (via drill 0.4)
  Top 0.508: v1.91,11.43 LED6.A
  Bottom 0.508: R34.1 v1.91,11.43
N$2
  Bottom 0.508: R31.1 10.79,32.8 10.79,37.47 9.53,38.73 R29.2
N$3
  Top 0.508: R29.3 5.71,37.47 IC9.2
  Bottom 0.508: IC9.2 6.67,36.2 C2.1 5.4,33.97 6.33,33.04 6.33,30.46 IC9.6
N$4
  Bottom 0.508: C1.2 IC9.5
N$6
  Bottom 0.508: IC9.7 6.99,30.7 R31.2 R30.1
N$11  (via drill 0.4)
  Top 0.508: v1.91,66.67 LED5.A
  Bottom 0.508: R33.1 v1.91,66.67
QA_IA_DIG1
  Top 0.508: JP1.1 IC1.12 | IC1.1 56.2,20.64 56.2,25.4 54.93,26.67 IC5.7
  Bottom 0.508: IC1.12 57.15,19.05 57.15,25.4 55.88,26.67 IC5.7
QA_IA_DIG2
  Top 0.508: JP2.1 IC2.12 | IC2.1 42.23,20.64 42.23,25.08 IC6.7
  Bottom 0.508: IC2.12 43.18,19.05 43.18,25.4 41.91,26.67 IC6.7
QA_IA_DIG3
  Top 0.508: JP3.1 IC3.12 | IC3.1 28.26,20.64 28.26,25.08 IC7.7
  Bottom 0.508: IC3.12 29.21,19.05 29.21,25.4 27.94,26.67 IC7.7
QA_IA_DIG4
  Top 0.508: JP4.1 IC4.12 | IC4.1 14.29,20.64 14.29,25.08 IC8.7
  Bottom 0.508: IC4.12 15.24,19.05 15.24,25.4 13.97,26.67 IC8.7
QB_IB_DIG1
  Top 0.508: JP1.2 IC1.9 59.69,8.89 59.69,24.77 58.1,26.35 58.1,38.42 IC5.1
QB_IB_DIG2
  Top 0.508: JP2.2 IC2.9 45.72,8.89 45.72,24.77 44.13,26.35 44.13,38.42 IC6.1
QB_IB_DIG3
  Top 0.508: JP3.2 IC3.9 31.75,8.89 31.75,24.77 30.16,26.35 30.16,38.42 IC7.1
QB_IB_DIG4
  Top 0.508: JP4.2 IC4.9 17.78,8.89 17.78,24.77 16.19,26.35 16.19,38.42 IC8.1
QC_IC_DIG1
  Top 0.508: JP1.3 IC1.8 57.15,8.89 57.15,36.83 IC5.2
QC_IC_DIG2
  Top 0.508: JP2.3 IC2.8 43.18,8.89 43.18,36.83 IC6.2
QC_IC_DIG3
  Top 0.508: JP3.3 IC3.8 29.21,8.89 29.21,36.83 IC7.2
QC_IC_DIG4
  Top 0.508: JP4.3 IC4.8 15.24,8.89 15.24,36.83 IC8.2
QD_ID_DIG1
  Bottom 0.508: JP1.4 63.5,5.08 63.5,10.16 IC1.11 55.88,17.78 55.88,20.32 54.61,21.59 | IC5.6 53.34,27.94 53.34,22.86 54.61,21.59 | IC2.14 52.07,19.05 54.61,21.59
QD_ID_DIG2
  Bottom 0.508: JP2.4 49.53,5.08 49.53,10.16 IC2.11 41.91,17.78 41.91,20.32 40.64,21.59 | IC6.6 39.37,27.94 39.37,22.86 40.64,21.59 | IC3.14 38.1,19.05 40.64,21.59
QD_ID_DIG3
  Bottom 0.508: JP3.4 35.56,5.08 35.56,10.16 IC3.11 27.94,17.78 27.94,20.32 26.67,21.59 | IC7.6 25.4,27.94 25.4,22.86 26.67,21.59 | IC4.14 24.13,19.05 26.67,21.59
QD_ID_DIG4
  Bottom 0.508: JP4.4 21.59,5.08 21.59,10.16 IC4.11 13.97,17.78 13.97,20.32 11.43,22.86 11.43,27.94 IC8.6
R9_DIG
  Top 0.508: IC2.7 IC2.6 | IC3.7 IC3.6 | IC1.7 IC1.6 | IC4.6 IC4.7 15.24,1.27 24.13,1.27 IC3.7 | IC3.7 29.21,1.27 38.1,1.27 IC2.7 | IC2.7 43.18,1.27 51.73,1.27 54.27,3.81 IC1.7 | R32.2 55.03,3.81 IC1.7
  Bottom 0.508: S1.2 4.94,21.23 C3.2 7.76,21.23 S1.1 9.6,17.07 11.43,15.24 13.34,15.24 13.97,14.61 13.97,7.62 IC4.6
SIGNAL_INPUT
  Top 0.508: JP13.2 8.89,53.34 1.91,53.34 0.64,52.07 0.64,19.68 1.27,19.05 R35.1 2.54,19.05
SIGNAL_INPUT_
  Top 0.508: JP14.3 6.99,17.78 5.71,19.05 R35.2
VCC  (via drill 0.4)
  Top 0.508: C6.1 63.81,41.91 IC5.16 | LED1.3 60.96,52.07 63.5,52.07 LED1.5 | LED2.5 49.53,52.07 46.99,52.07 LED2.3 | LED3.5 35.56,52.07 33.02,52.07 LED3.3 | LED4.5 21.59,52.07 19.05,52.07 LED4.3
  Top 0.61: 66.36,40.95 v66.99,41.59 | C6.1 66.36,40.95 | 66.36,40.95 v66.99,40.32
  Top 0.813: C5.1 v10.16,11.43 v10.16,10.16
  Bottom 0.508: X1.1 7.59,54.58 | 7.59,54.58 JP15.2 | 7.62,54.55 7.59,54.58
  pour Bottom: 0,69 0,0 70,0 70,69

### Text on the board
Top: Jarek Paral | Robotarna / RobotikaBrno | People-counter-74xx v1.1
tDocu: ON | - | GND | S | +5V | Jarek Paral | + | A | A | A | A | Robotarna / RobotikaBrno | RESET | INP | G | G | G | G | SIG | 1 | 1 | 1 | 1 | GEN | 8 | 8 | 8 | People-counter-74xx v1.1 | CC BY-SA 4.0